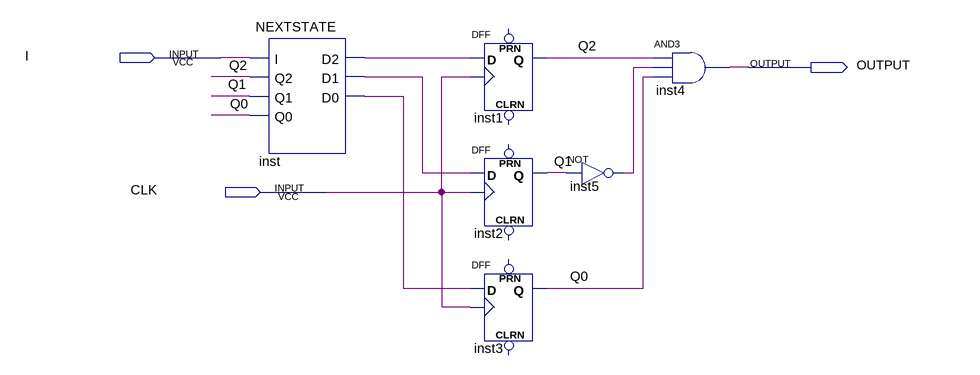
[diagram p0: schematic sheet]
// Quartus schematic MOORE_LBSMSSV.bdf as structural Verilog: 6 symbols, 3 pins
module MOORE_LBSMSSV (
  input  I,
  input  CLK,
  output OUTPUT
);

  wire inst5_out, inst_d0, inst_d1, inst_d2, Q0, Q1, Q2;

  NEXTSTATE inst (.I(I), .Q2(Q2), .Q1(Q1), .Q0(Q0), .D2(inst_d2), .D1(inst_d1), .D0(inst_d0));
  DFF inst1 (.CLK(CLK), .D(inst_d2), .Q(Q2));  // open: CLRN, PRN
  DFF inst2 (.CLK(CLK), .D(inst_d1), .Q(Q1));  // open: CLRN, PRN
  DFF inst3 (.CLK(CLK), .D(inst_d0), .Q(Q0));  // open: CLRN, PRN
  not inst5 (inst5_out, Q1);
  and inst4 (OUTPUT, Q2, inst5_out, Q0);
endmodule
